# Altium schematic sheet Micro.SchDoc
size A3; SheetNumber: 5; SheetTotal: 9
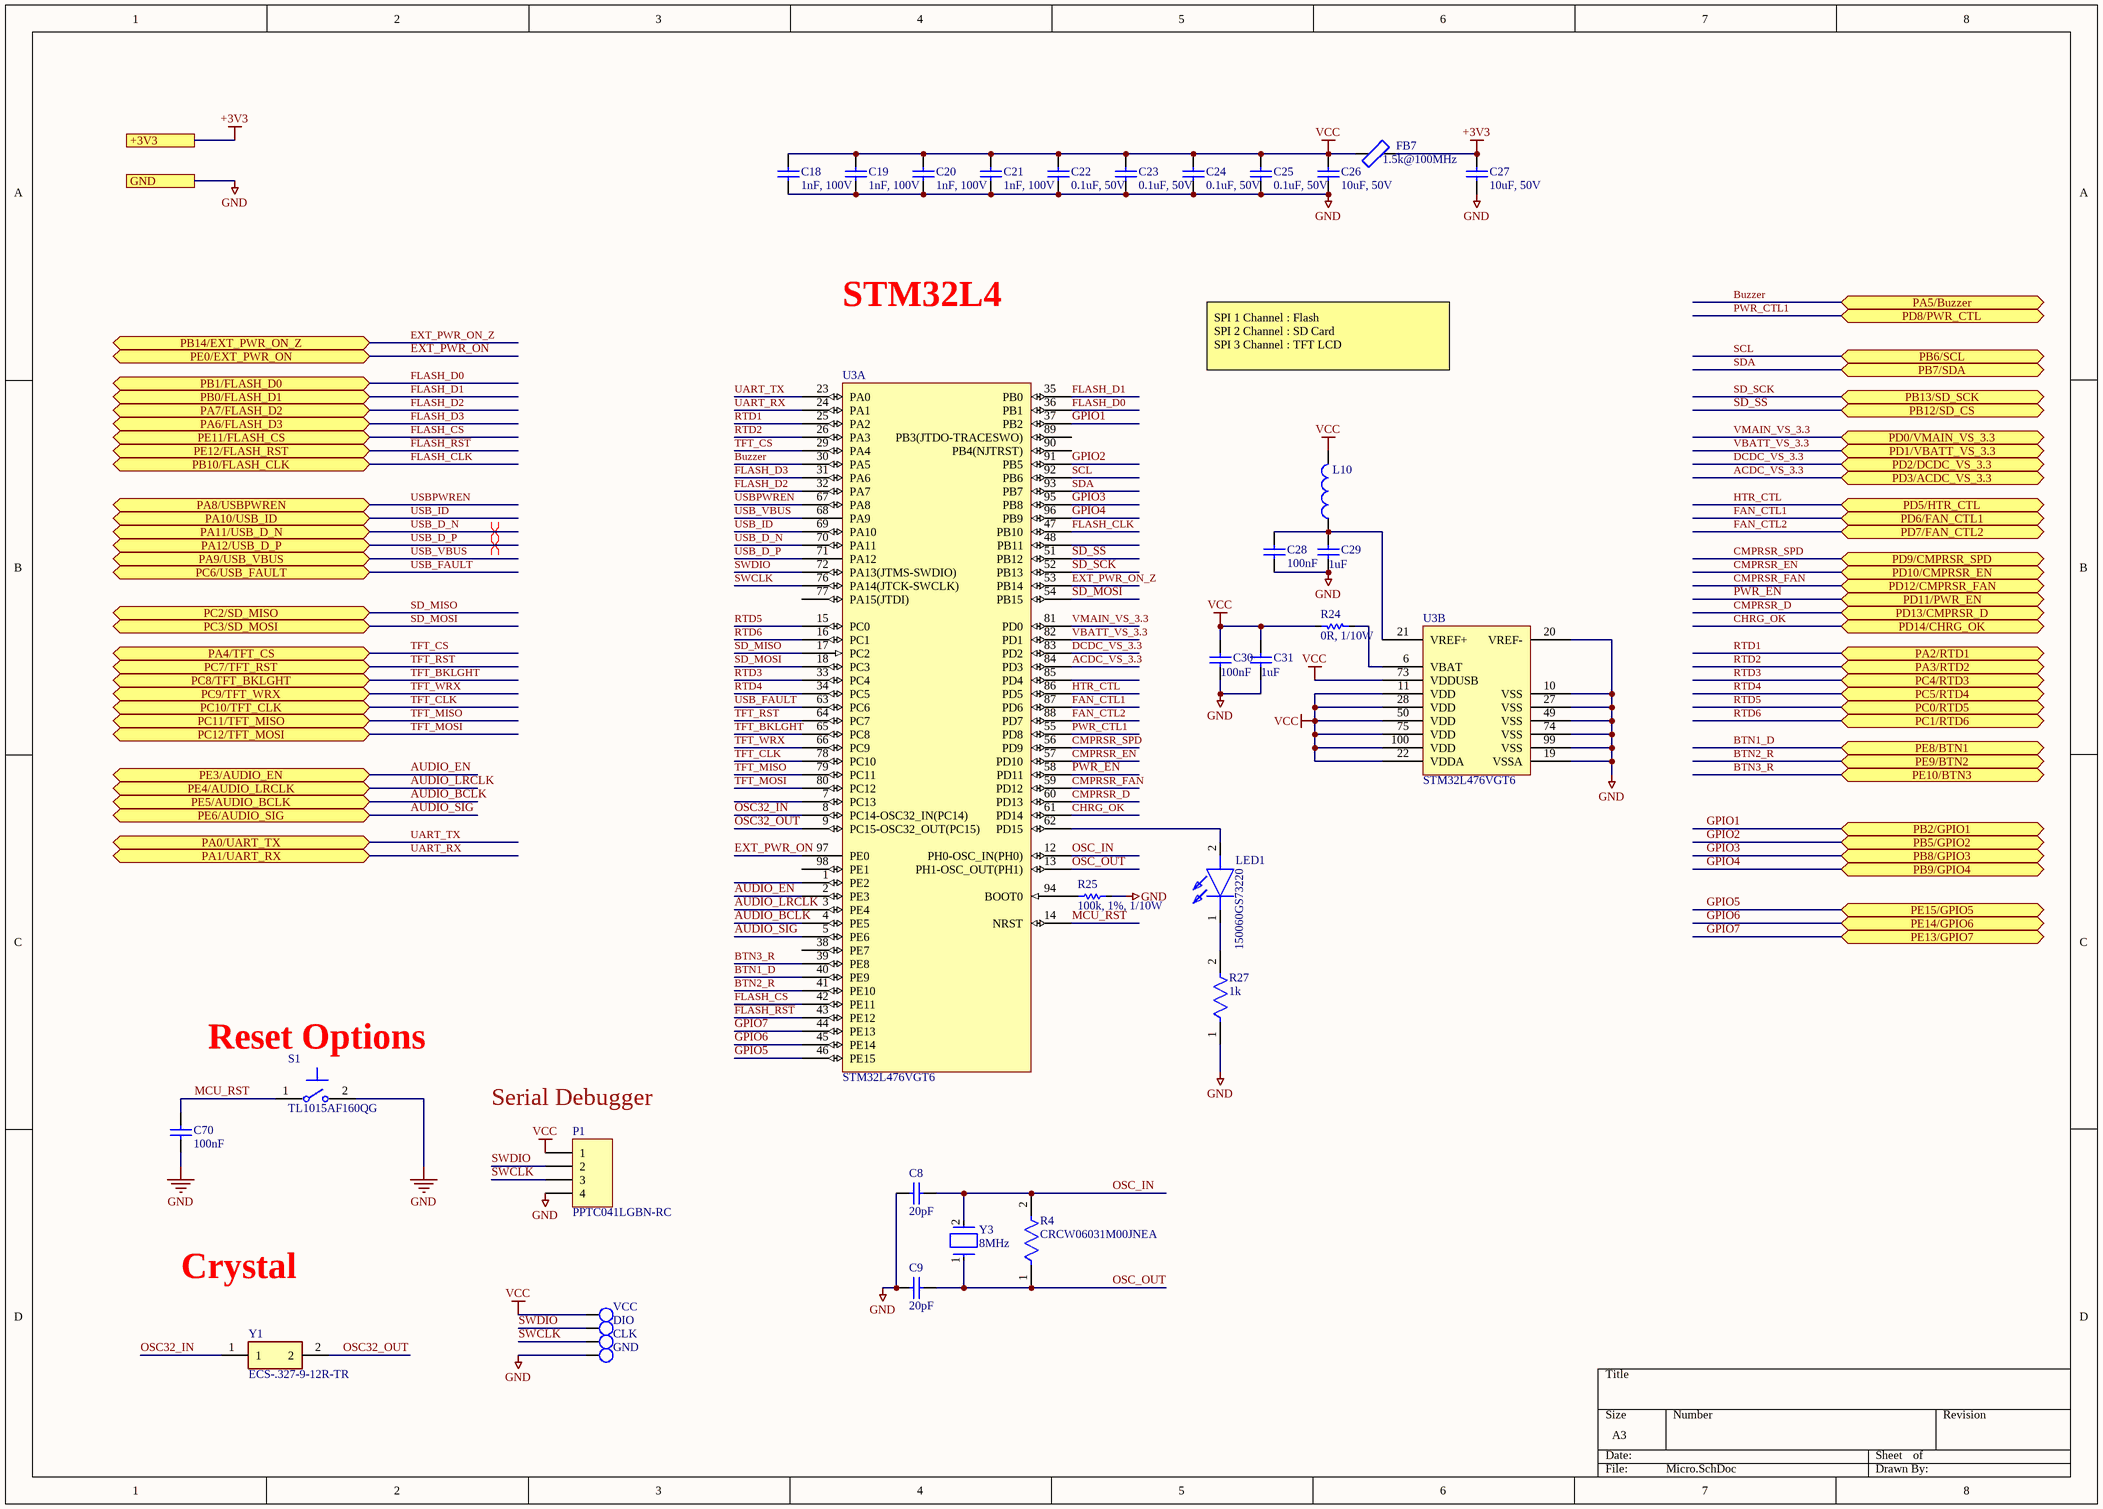
[diagram p0: Micro.SchDoc]

## Parts
C8  20pF  [CAPC1608X90X35ML10T15]
C9  20pF  [CAPC1608X90X35ML10T15]
C18  1nF, 100V  [0603]
C19  1nF, 100V  [0603]
C20  1nF, 100V  [0603]
C21  1nF, 100V  [0603]
C22  0.1uF, 50V  [0805]
C23  0.1uF, 50V  [0805]
C24  0.1uF, 50V  [0805]
C25  0.1uF, 50V  [0805]
C26  10uF, 50V  [1206]
C27  10uF, 50V  [1206]
C28  100nF  [CAPC1005X55X30LL05T10]
C29  value 1uF  [C1206]  (hidden comment: C1206C105K4RACTU)
C30  100nF  [CAPC1005X55X30LL05T10]
C31  value 1uF  [C1206]  (hidden comment: C1206C105K4RACTU)
C70  100nF  [CAPC1005X55X30LL05T10]
CLK  2mm  [TEST POINT 40 Mil]  (value not drawn)  (no BOM)
DIO  2mm  [TEST POINT 40 Mil]  (value not drawn)  (no BOM)
FB7  1.5k@100MHz  [0805]
GND  2mm  [TEST POINT 40 Mil]  (value not drawn)  (no BOM)
L10  BLM03AX121SN1D  [0603]  (value not drawn)
LED1  150060GS73220  [LED0603]
P1  PPTC041LGBN-RC  [HDR1X4]
R4  CRCW06031M00JNEA  [FP-CRCW0603-e3-IPC_B]
R24  0R, 1/10W  [0603]
R25  100k, 1%, 1/10W  [0603]
R27  1k  [FP-MCT0603-MFG]
S1  TL1015AF160QG  [FP-TL1015AF160QG-MFG]
U3  STM32L476VGT6  [STM-LQFP100_L]  (parts A,B of 2)
VCC  2mm  [TEST POINT 40 Mil]  (value not drawn)  (no BOM)
Y1  ECS-.327-9-12R-TR  [ABS0612732768KHZT]
Y3  8MHz  [FP-ABM3-MFG]

## Ports
+3V3, GND, PA0/UART_TX (bidir), PA1/UART_RX (bidir), PA2/RTD1 (bidir), PA3/RTD2 (bidir), PA4/TFT_CS (bidir), PA5/Buzzer (bidir), PA6/FLASH_D3 (bidir), PA7/FLASH_D2 (bidir), PA8/USBPWREN (bidir), PA9/USB_VBUS (bidir), PA10/USB_ID (bidir), PA11/USB_D_N (bidir), PA12/USB_D_P (bidir), PB0/FLASH_D1 (bidir), PB1/FLASH_D0 (bidir), PB2/GPIO1 (bidir), PB5/GPIO2 (bidir), PB6/SCL (bidir), PB7/SDA (bidir), PB8/GPIO3 (bidir), PB9/GPIO4 (bidir), PB10/FLASH_CLK (bidir), PB12/SD_CS (bidir), PB13/SD_SCK (bidir), PB14/EXT_PWR_ON_Z (bidir), PC0/RTD5 (bidir), PC1/RTD6 (bidir), PC2/SD_MISO (bidir), PC3/SD_MOSI (bidir), PC4/RTD3 (bidir), PC5/RTD4 (bidir), PC6/USB_FAULT (bidir), PC7/TFT_RST (bidir), PC8/TFT_BKLGHT (bidir), PC9/TFT_WRX (bidir), PC10/TFT_CLK (bidir), PC11/TFT_MISO (bidir), PC12/TFT_MOSI (bidir), PD0/VMAIN_VS_3.3 (bidir), PD1/VBATT_VS_3.3 (bidir), PD2/DCDC_VS_3.3 (bidir), PD3/ACDC_VS_3.3 (bidir), PD5/HTR_CTL (bidir), PD6/FAN_CTL1 (bidir), PD7/FAN_CTL2 (bidir), PD8/PWR_CTL (bidir), PD9/CMPRSR_SPD (bidir), PD10/CMPRSR_EN (bidir), PD11/PWR_EN (bidir), PD12/CMPRSR_FAN (bidir), PD13/CMPRSR_D (bidir), PD14/CHRG_OK (bidir), PE0/EXT_PWR_ON (bidir), PE3/AUDIO_EN (bidir), PE4/AUDIO_LRCLK (bidir), PE5/AUDIO_BCLK (bidir), PE6/AUDIO_SIG (bidir), PE8/BTN1 (bidir), PE9/BTN2 (bidir), PE10/BTN3 (bidir), PE11/FLASH_CS (bidir), PE12/FLASH_RST (bidir), PE13/GPIO7 (bidir), PE14/GPIO6 (bidir), PE15/GPIO5 (bidir)

## Nets
+3V3: C27.2 FB7.2 ; port +3V3
GND: C8.2 C9.2 C18.1 C19.1 C20.1 C21.1 C22.1 C23.1 C24.1 C25.1 C26.1 C27.1 C28.1 C29.1 C30.1 C31.1 C70.1 GND.1(TP) P1.4 R25.1 R27.1 S1.2 U3.10(VSS) U3.19(VSSA) U3.20(VREF-) U3.27(VSS) U3.49(VSS) U3.74(VSS) U3.99(VSS) ; port GND
VCC: C18.2 C19.2 C20.2 C21.2 C22.2 C23.2 C24.2 C25.2 C26.2 C30.2 C31.2 FB7.1 L10.2 P1.1 R24.2 U3.11(VDD) U3.22(VDDA) U3.28(VDD) U3.50(VDD) U3.73(VDDUSB) U3.75(VDD) U3.100(VDD) VCC.1(TP)
~{FLASH_RST}: U3.43(PE12) ; port PE12/FLASH_RST
ACDC_VS_3.3: U3.84(PD3) ; port PD3/ACDC_VS_3.3
AUDIO_BCLK: U3.4(PE5) ; port PE5/AUDIO_BCLK
AUDIO_EN: U3.2(PE3) ; port PE3/AUDIO_EN
AUDIO_LRCLK: U3.3(PE4) ; port PE4/AUDIO_LRCLK
AUDIO_SIG: U3.5(PE6) ; port PE6/AUDIO_SIG
BTN1_D: U3.40(PE9) ; port PE8/BTN1
BTN2_R: U3.41(PE10) ; port PE9/BTN2
BTN3_R: U3.39(PE8) ; port PE10/BTN3
Buzzer: U3.30(PA5) ; port PA5/Buzzer
CHRG_OK: U3.61(PD14) ; port PD14/CHRG_OK
CMPRSR_D: U3.60(PD13) ; port PD13/CMPRSR_D
CMPRSR_EN: U3.57(PD10) ; port PD10/CMPRSR_EN
CMPRSR_FAN: U3.59(PD12) ; port PD12/CMPRSR_FAN
CMPRSR_SPD: U3.56(PD9) ; port PD9/CMPRSR_SPD
DCDC_VS_3.3: U3.83(PD2) ; port PD2/DCDC_VS_3.3
EXT_PWR_ON: U3.97(PE0) ; port PE0/EXT_PWR_ON
EXT_PWR_ON_Z: U3.53(PB14) ; port PB14/EXT_PWR_ON_Z
FAN_CTL1: U3.87(PD6) ; port PD6/FAN_CTL1
FAN_CTL2: U3.88(PD7) ; port PD7/FAN_CTL2
FLASH_CLK: U3.47(PB10) ; port PB10/FLASH_CLK
FLASH_CS: U3.42(PE11) ; port PE11/FLASH_CS
FLASH_D0: U3.36(PB1) ; port PB1/FLASH_D0
FLASH_D1: U3.35(PB0) ; port PB0/FLASH_D1
FLASH_D2: U3.32(PA7) ; port PA7/FLASH_D2
FLASH_D3: U3.31(PA6) ; port PA6/FLASH_D3
GPIO1: U3.37(PB2) ; port PB2/GPIO1
GPIO2: U3.91(PB5) ; port PB5/GPIO2
GPIO3: U3.95(PB8) ; port PB8/GPIO3
GPIO4: U3.96(PB9) ; port PB9/GPIO4
GPIO5: U3.46(PE15) ; port PE15/GPIO5
GPIO6: U3.45(PE14) ; port PE14/GPIO6
GPIO7: U3.44(PE13) ; port PE13/GPIO7
HTR_CTL: U3.86(PD5) ; port PD5/HTR_CTL
MCU_RST: C70.2 S1.1 U3.14(NRST)
OSC32_IN: U3.8(PC14-OSC32_IN(PC14)) Y1.1
OSC32_OUT: U3.9(PC15-OSC32_OUT(PC15)) Y1.2
OSC_IN: C8.1 R4.2 U3.12(PH0-OSC_IN(PH0)) Y3.2
OSC_OUT: C9.1 R4.1 U3.13(PH1-OSC_OUT(PH1)) Y3.1
PWR_CTL1: U3.55(PD8) ; port PD8/PWR_CTL
PWR_EN: U3.58(PD11) ; port PD11/PWR_EN
RTD1: U3.25(PA2) ; port PA2/RTD1
RTD2: U3.26(PA3) ; port PA3/RTD2
RTD3: U3.33(PC4) ; port PC4/RTD3
RTD4: U3.34(PC5) ; port PC5/RTD4
RTD5: U3.15(PC0) ; port PC0/RTD5
RTD6: U3.16(PC1) ; port PC1/RTD6
SCL: U3.92(PB6) ; port PB6/SCL
SD_MISO: U3.17(PC2) ; port PC2/SD_MISO
SD_MOSI: U3.18(PC3) U3.54(PB15) ; port PC3/SD_MOSI
SD_SCK: U3.52(PB13) ; port PB13/SD_SCK
SD_SS: U3.51(PB12) ; port PB12/SD_CS
SDA: U3.93(PB7) ; port PB7/SDA
SWCLK: CLK.1(TP) P1.3 U3.76(PA14(JTCK-SWCLK))
SWDIO: DIO.1(TP) P1.2 U3.72(PA13(JTMS-SWDIO))
TFT_BKLGHT: U3.65(PC8) ; port PC8/TFT_BKLGHT
TFT_CLK: U3.78(PC10) ; port PC10/TFT_CLK
TFT_CS: U3.29(PA4) ; port PA4/TFT_CS
TFT_MISO: U3.79(PC11) ; port PC11/TFT_MISO
TFT_MOSI: U3.80(PC12) ; port PC12/TFT_MOSI
TFT_RST: U3.64(PC7) ; port PC7/TFT_RST
TFT_WRX: U3.66(PC9) ; port PC9/TFT_WRX
UART_RX: U3.24(PA1) ; port PA1/UART_RX
UART_TX: U3.23(PA0) ; port PA0/UART_TX
USB_D_N: U3.70(PA11) ; port PA11/USB_D_N
USB_D_P: U3.71(PA12) ; port PA12/USB_D_P
USB_FAULT: U3.63(PC6) ; port PC6/USB_FAULT
USB_ID: U3.69(PA10) ; port PA10/USB_ID
USB_VBUS: U3.68(PA9) ; port PA9/USB_VBUS
USBPWREN: U3.67(PA8) ; port PA8/USBPWREN
VBATT_VS_3.3: U3.82(PD1) ; port PD1/VBATT_VS_3.3
VMAIN_VS_3.3: U3.81(PD0) ; port PD0/VMAIN_VS_3.3
NetC28_2: C28.2 C29.2 L10.1 U3.21(VREF+)
NetLED1_1: LED1.1(K) R27.2
NetLED1_2: LED1.2(A) U3.62(PD15)
NetR24_1: R24.1 U3.6(VBAT)
NetR25_2: R25.2 U3.94(BOOT0)

Not connected (* = marked no-connect by the designer): U3 1(PE2) 7(PC13) 38(PE7) 48(PB11) 77(PA15(JTDI)) 85(PD4) 89(PB3(JTDO-TRACESWO)) 90(PB4(NJTRST)) 98(PE1)

## Layout directives
differential pair: USB_D_N, USB_D_P

## Notes on the sheet
- STM32L4
- SPI 1 Channel : Flash
  SPI 2 Channel : SD Card
  SPI 3 Channel : TFT LCD
- (near S1) Reset Options
- (near P1) Serial Debugger
- Crystal

## Library data of the parts
C8 C9 = CMP-2006-02630-1: GRM1885C1H200JA01J; Manufacturer: Murata; Part Number: GRM1885C1H200JA01J
C18-C21 = NS00847: CAP CER 1000PF 100V C0G/NP0 0603; Type: C; Alternatives: Generic; Part Number: NS00847; Value: 1nF, 100V; Supplier 1: Digi-Key; Supplier Part Number 1: 732-12187-1-ND
C22-C25 = NS00353: 0.10µF ±10% 50V Ceramic Capacitor X7R 0805 (2012 Metric); Type: C; Alternatives: Generic; Part Number: NS00353; Value: 0.1uF, 50V; Supplier 1: Digi-Key; Supplier Part Number 1: 478-1395-1-ND
C26 C27 = NS00832: CAP CER 10UF 50V X7R 1206; Type: C; Alternatives: Generic; Part Number: NS00832; Value: 10uF, 50V; Supplier 1: Digi-Key; Supplier Part Number 1: 1276-6767-1-ND
C28 C30 C70 = CMP-0001-00074-2: Supplier 1: Digi-Key; Supplier Part Number 1: 399-C0402C104K4RAC7867TR-ND
C29 C31 = Cap Semi: Capacitor (Semiconductor SIM Model); Published: 8-Jun-2000; LatestRevisionDate: 29-May-2009; LatestRevisionNote: IPC-7351 Footprint Added.; PackageReference: C1206; Publisher: Altium Limited; PackageDescription: Chip Capacitor; Supplier 1: Digi-Key; Supplier Part Number 1: 399-C1206C105K4RAC7800TR-ND
CLK DIO GND VCC = NS00254: Testpoint 2mm round; Part Number: NS00254; Type: Mechanical; Value: 2mm
FB7 = NS00881: WE-CBA SMT EMI SUPPRESSION FERRITE; Type: Inductor; Part Number: NS00881; Value: 1.5k@100MHz; ComponentLink1Description: Datasheet; ComponentLink1URL: H:\Doc\Wurth\782853162.pdf; Supplier 1: Digi-Key; Supplier Part Number 1: 732-782853162CT-ND
L10 = Inductor: Code_IEC: 1005; Published: 8-Jun-2000; LatestRevisionDate: 29-May-2009; LatestRevisionNote: IPC-7351 Footprint Added.; PackageReference: 0402-A; Publisher: Altium Limited; PackageDescription: Chip Inductor; Code_JEITA: 0402; Value: BLM03AX121SN1D; Supplier 1: Digi-Key; Supplier Part Number 1: 490-5622-2-ND
LED1 = 150060GS73220: LED; Manufacturer_Name: Wurth Elektronik; Datasheet Link: https://katalog.we-online.de/led/datasheet/150060GS73220.pdf; Height: 0.3mm; Manufacturer_Part_Number: 150060GS73220; Mouser Part Number: 710-150060GS73220; Mouser Price/Stock: https://www.mouser.com/Search/Refine.aspx?Keyword=710-150060GS73220; RS Part Number: 1766086; RS Price/Stock: https://uk.rs-online.com/web/p/products/1766086; Supplier 1: Digi-Key; Supplier Part Number 1: 732-11995-2-ND
P1 = Header 4: Header, 4-Pin; LatestRevisionDate: 17-Jul-2002; LatestRevisionNote: Re-released for DXP Platform.; Publisher: Altium Limited; Supplier 1: Digi-Key; Supplier Part Number 1: SAM1112-04-ND
R4 = CMP-2000-03016-2: RES Thick Film, 1MΩ, 5%, 0.1W, 200ppm/°C, 0603; Max Power Dissipation: 100mW; Resistance: 1MR; Voltage Rating: 75V; Temperature Coefficient: 200ppm/°C; Military Standard: Not; Mount: Surface Mount; Package Quantity: 1; Number of Pins: 2; Power Rating: 100mW; Packaging: Tape and Reel; Length: 1.55mm; Width: 0.85mm; Height: 0.02inch; Min Operating Temperature: -55°C; Tolerance: 5%; Depth: 0.85mm; Composition: Thick Film; Number of Terminations: 2; Max Operating Temperature: 155°C; Termination: SMD/SMT; Case Code (Imperial): 0603; Weight: 7.1E-05oz; Case Code (Metric): 1608; Radiation Hardening: No; Contact Plating: Tin; Case/Package: 0603; Features: Automotive AEC-Q200
R24 = NS00876: RES 0 OHM JUMPER 1/10W 0603; Alternatives: Generic; Part Number: NS00876; Type: R; Value: 0R, 1/10W; Supplier 1: Digi-Key; Supplier Part Number 1: RMCF0603ZT0R00CT-ND
R25 = NS00835: RES 100K OHM 1% 1/10W 0603; Alternatives: Generic; Part Number: NS00835; Type: R; Value: 100k, 1%, 1/10W; Supplier 1: Digi-Key; Supplier Part Number 1: RMCF0603FT100KCT-ND; Parameter 1: *
R27 = CMP-02407-007689-1: RES SMD 1 kOHM 1% 1/8W 0603; Power Rating: 125mW; Voltage Rating: 75V; Resistance: 150R; Temperature Coefficient: 25ppm/°C; Tolerance: 0.1%; Length: 0.061inch; Composition: Thin Film; Weight: 7.1E-05oz; Case Code (Imperial): 0603; Voltage Rating (DC): 75V; Termination: SMD/SMT; Max Power Dissipation: 125mW; Case Code (Metric): 1608; Package Quantity: 1; Height: 0.45mm; Radiation Hardening: No; Width: 0.033inch; Max Operating Temperature: 155°C; Case/Package: 0603; Features: Automotive AEC-Q200; Contact Plating: Tin; Packaging: Tape and Reel; Number of Pins: 2; Number of Terminations: 2; REACH SVHC: No SVHC; Depth: 0.85mm; Min Operating Temperature: -55°C; Supplier 1: Digi-Key; Supplier Part Number 1: 311-1.0KGRTR-ND
S1 = CMP-17879-000003-1: SWITCH TACTILE SPST-NO 0.05A 12V; Actuator Type: Standard; Actuator Length: 0.5mm; Contact Current Rating: 50mA; Mechanical Life: 200000Cycles; Switch Function: Off-Mom; Switch Travel: 0.2mm; Illumination Type: Non-Illuminated; Operating Force: 160gf; Actuator Material: Nylon; Electrical Life: 50000Cycles; Throw Configuration: SPST; Contact Resistance: 100mR; Orientation: Straight; Max Voltage Rating (DC): 12V; Max Operating Temperature: 70°C; Package Quantity: 1; Contact Material: Silver; Packaging: Tape and Reel; Mount: Surface Mount; Color: Beige; Termination: Gull Wing; Case/Package: SMD/SMT; Voltage Rating (DC): 12V; Contact Plating: Silver; REACH SVHC: No SVHC; Min Operating Temperature: -20°C; Current Rating: 50mA; Lead Free: Lead Free; Supplier 1: Digi-Key; Supplier Part Number 1: EG4344TR-ND
U3 = CMP-1655-00015-2: Ultra-Low-Power ARM Cortex-M4 32-bit MCU+FPU, 1024 KB Flash, 128 KB Internal RAM, 82 I/Os, 100-Pin LQFP, -40 to 85 degC, Tray; Manufacturer: STMicroelectronics; I/Os (High Current): 82; Supply Voltage(Vcc) min (V): 1.71; Internal RAM Size (kB): 128; D/A Converter: 2; Operating Frequency(F) (Processor speed) (MHz): 80; FLASH Size (Prog) (kB): 1024; Packing: Tray; Package Description: 100-Pin Low Profile Quad Flat Package, Body 14 x 14 mm, Pitch 0.5 mm; Package Reference: LQFP100; ComponentLink1URL: http://www.st.com/; DatasheetVersion: Rev. 4; PartNumber: STM32L476VGT6; Core: ARM Cortex-M4; Mounting Technology: Surface Mount; ComponentLink1Description: Manufacturer URL; ComponentLink2URL: http://www.st.com/st-web-ui/static/active/en/resource/technical/document/datasheet/DM00108832.pdf; ComponentLink2Description: Datasheet; Supplier 1: Digi-Key; Supplier Part Number 1: 497-15873-ND
Y1 = ABS07W-32.768KHZ-J-1-T: Crystal or Oscillator; Manufacturer_Name: ABRACON; Datasheet Link: https://abracon.com/iotoptimized_quartzcrystals/assets/ABS07W.pdf; Manufacturer_Part_Number: ABS07W-32.768KHZ-J-1-T; Mouser Part Number: 815-ABS07W32.768KJ1T; Mouser Price/Stock: https://www.mouser.com/Search/Refine.aspx?Keyword=815-ABS07W32.768KJ1T; RS Part Number: 1710341P; RS Price/Stock: http://uk.rs-online.com/web/p/products/1710341P; Supplier 1: Digi-Key; Supplier Part Number 1: XC2745TR-ND
Y3 = CMP-2000-05033-2: Crystal 8MHz ±20ppm 18pF SMD-2 5mm x 3.2mm; Series Resistance: 500R; Frequency Stability: 30ppm; ESR (Equivalent Series Resistance): 140R; Load Capacitance: 18pF; Height: 0.051inch; Tolerance: 20ppm; Depth: 3.2mm; Max Operating Temperature: 85°C; Frequency: 8MHz; Termination: SMD/SMT; Lead Free: Lead Free; Number of Pins: 2; Width: 3.2mm; RoHS Compliant: Yes; Resistor Type: Ceramic; Length: 5mm; Mount: Surface Mount; Case/Package: CSMD; Package Quantity: 1000; Radiation Hardening: No; Min Operating Temperature: -40°C; Packaging: Tape and Reel; Frequency Tolerance: 20ppm; Supplier 1: Digi-Key; Supplier Part Number 1: ABM3-8.000MHZ-D2Y-T